# EAGLE design Erica-HAT (EAGLE 6.5.0)
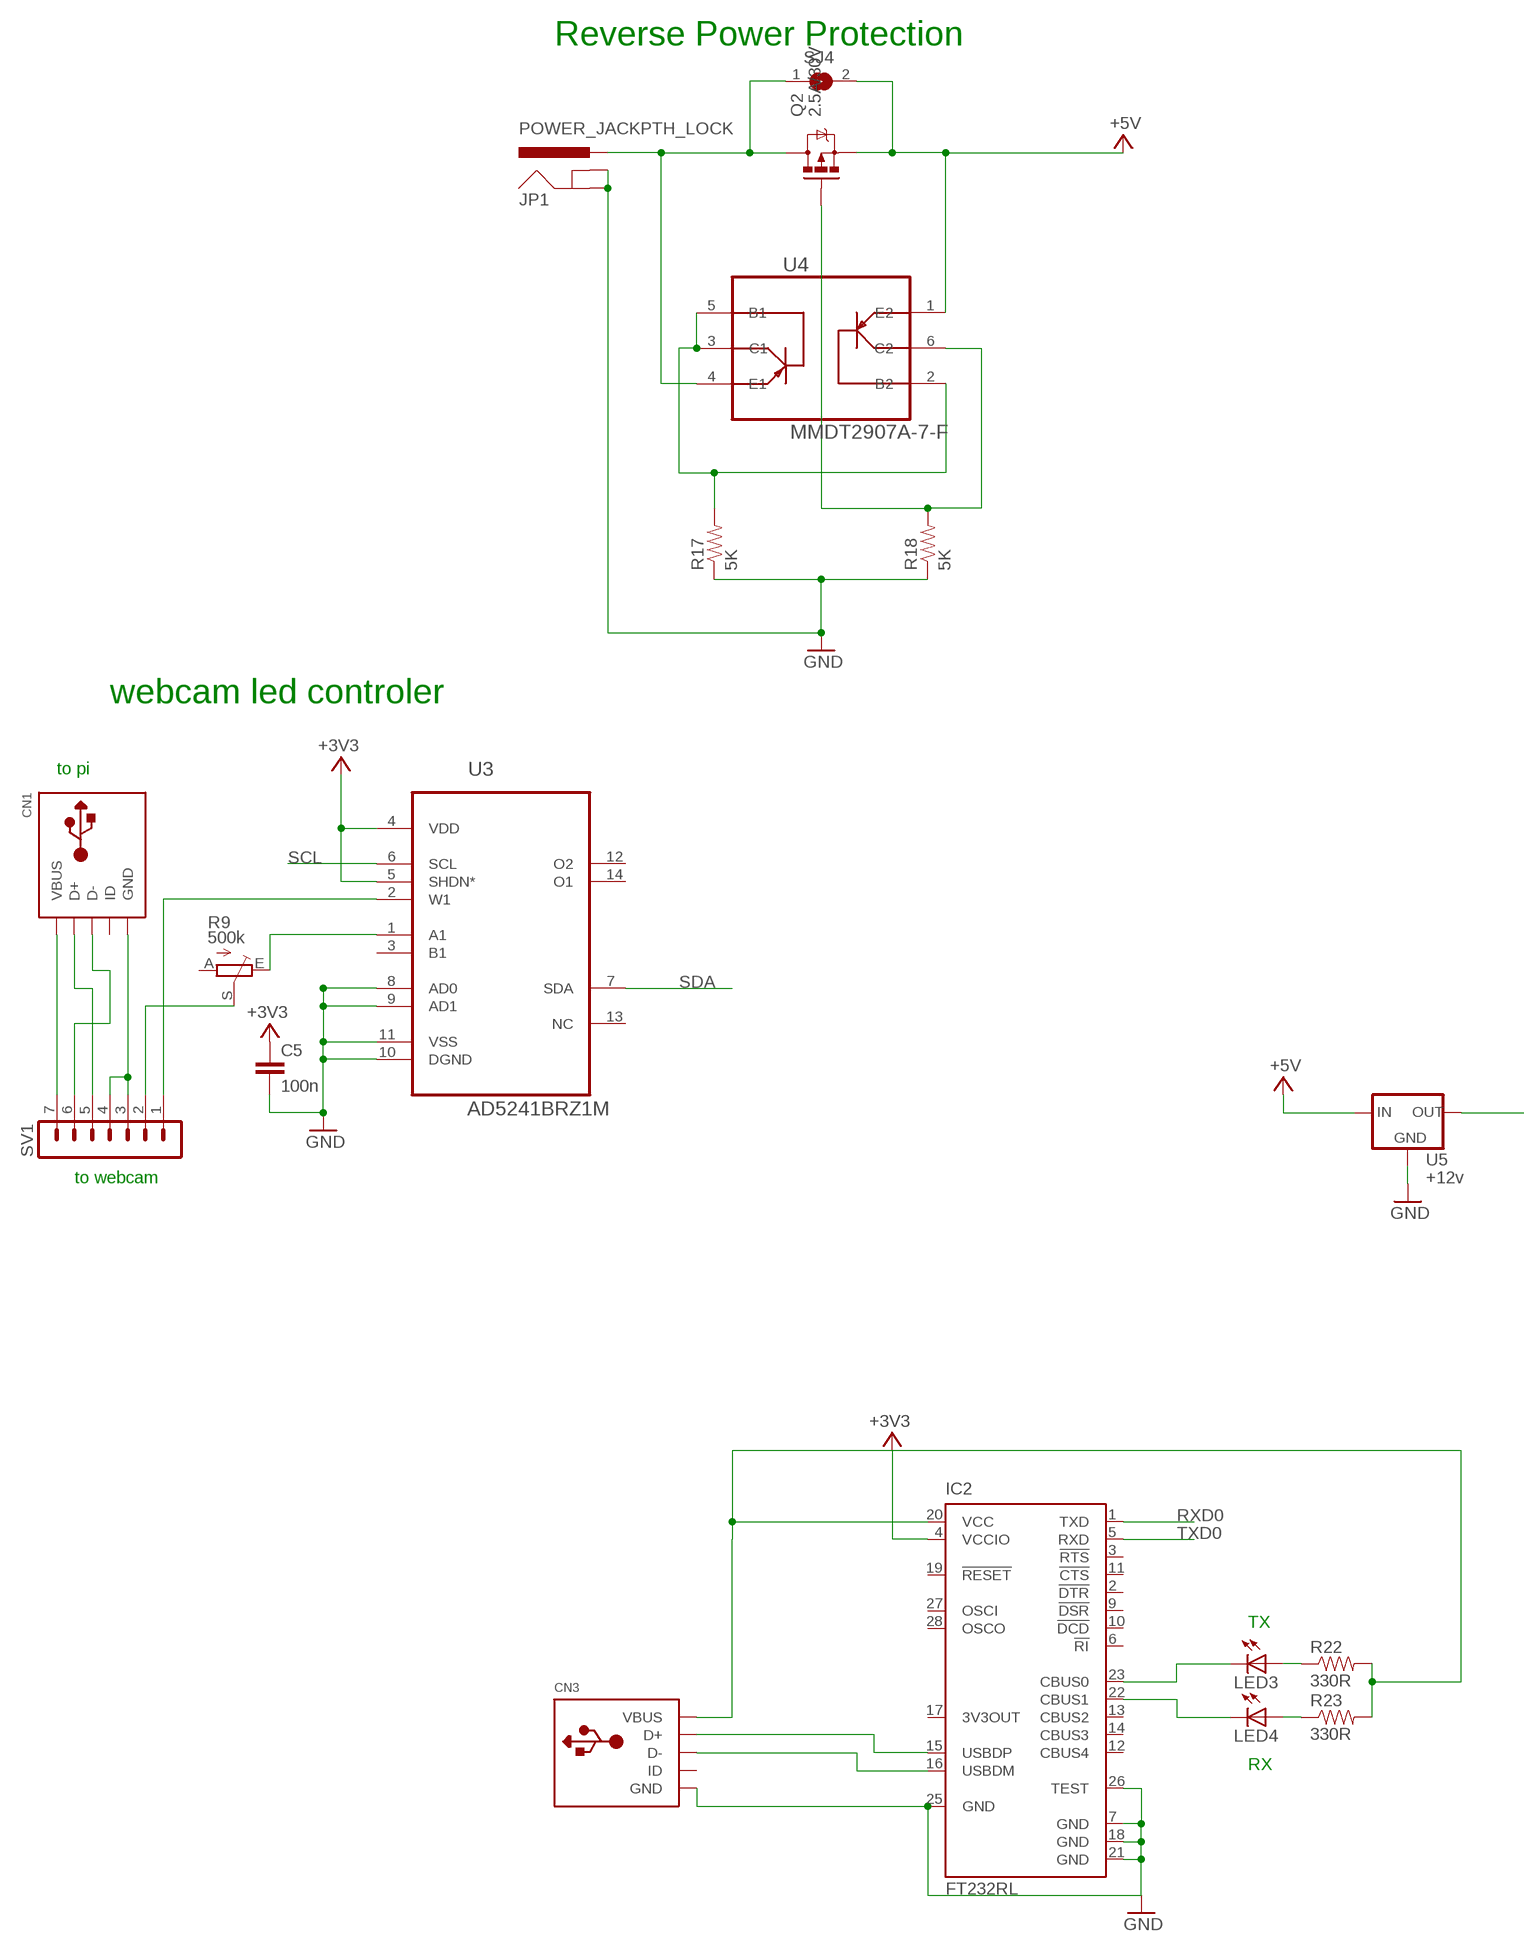
[diagram p0: schematic, sheet 1, part 1 of 2]
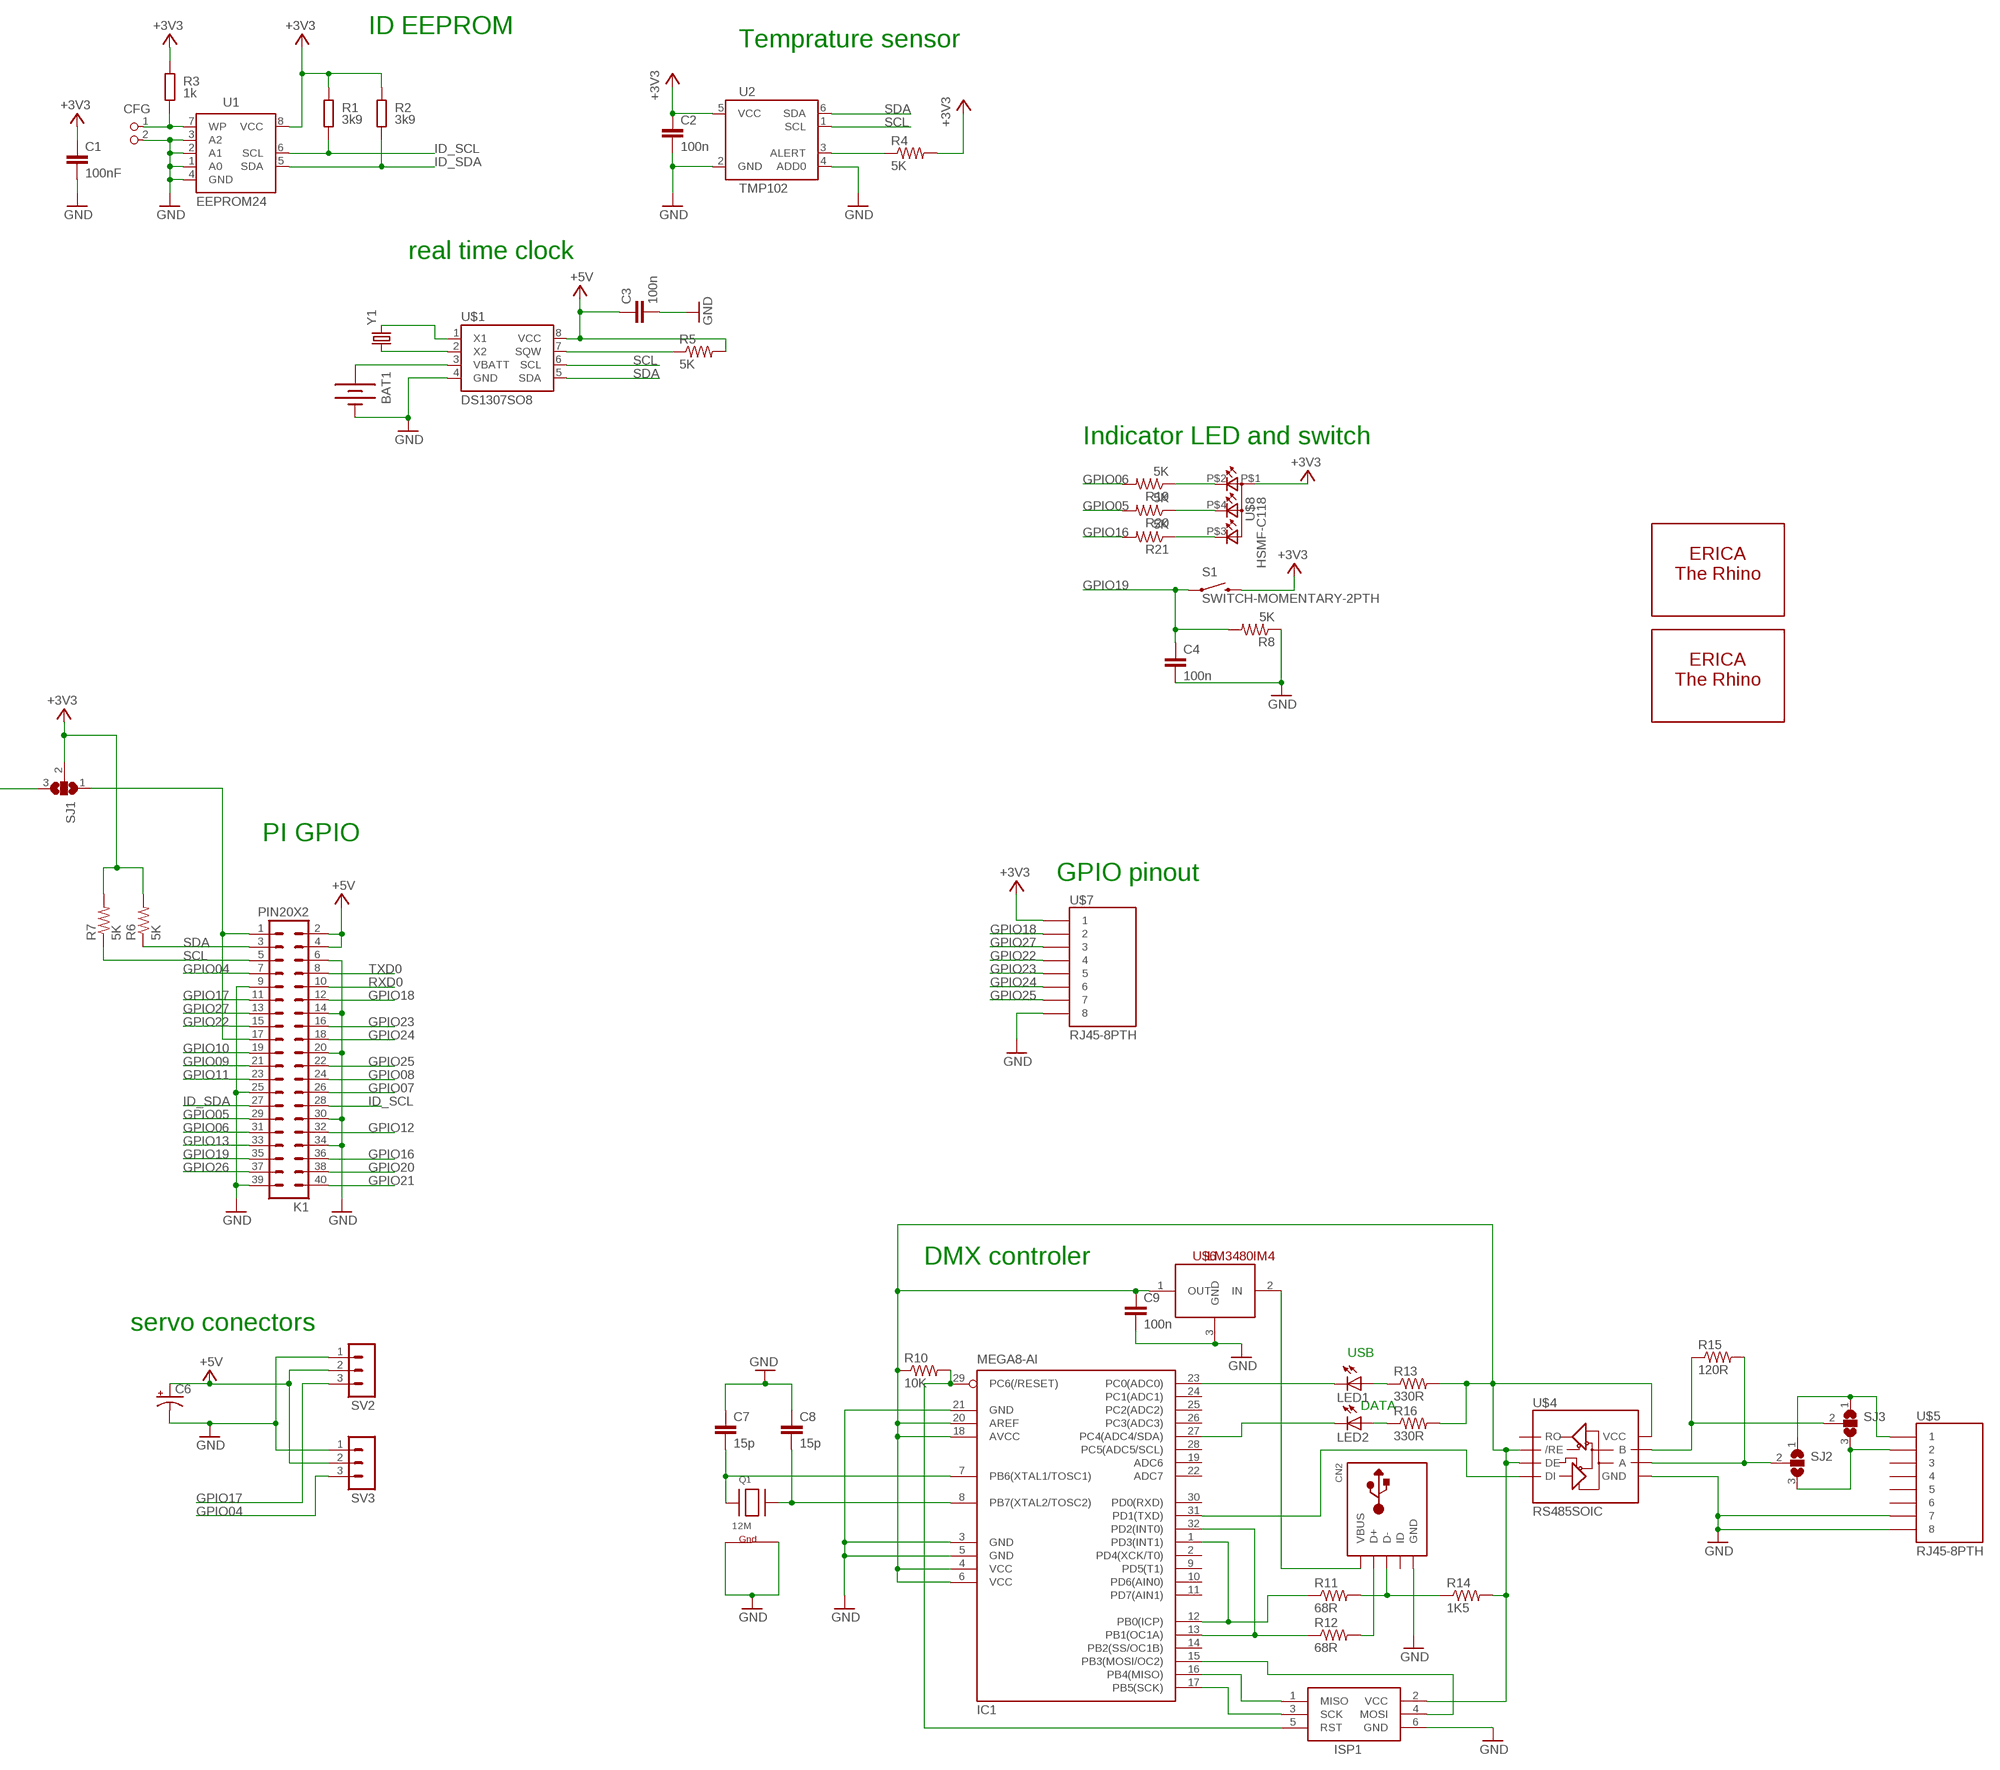
[diagram p1: schematic, sheet 1, part 2 of 2]

## Parts
BAT1  BATTERY12MM  [BATTCON_12MM]
C1  100nF  C-EUC0805K  [C0805K]
C2  100n  CAP0603-CAP  [0603-CAP]
C3  100n  CAP0603-CAP  [0603-CAP]
C4  100n  CAP0603-CAP  [0603-CAP]
C5  100n  CAP0603-CAP  [0603-CAP]
C6  CAP_POLPTH2  [CPOL-RADIAL-10UF-25V]
C7  15p  CAP0603-CAP  [0603-CAP]
C8  15p  CAP0603-CAP  [0603-CAP]
C9  100n  CAP0603-CAP  [0603-CAP]
CFG  PIN2_100  [PIN_W_2]
CN1  USBMINIB  [USB-MINIB]
CN2  USBMINIB  [USB-MINIB]
CN3  USBMINIB  [USB-MINIB]
IC1  MEGA8-AI  [TQFP32-08]
IC2  FT232RL  [SSOP28]
ISP1  AVRISP-6  [AVRISP]
JP1  POWER_JACKPTH_LOCK  [POWER_JACK_PTH_LOCK]
K1  PIN20X2  [PIN_20X2]
LED1  LEDCHIP-LED0603  [CHIP-LED0603]
LED2  LEDCHIP-LED0603  [CHIP-LED0603]
LED3  LEDCHIP-LED0603  [CHIP-LED0603]
LED4  LEDCHIP-LED0603  [CHIP-LED0603]
Q1  12M  XTAL-4-3225  [NX3225]
Q2  2.5A/30V  MOSFET-PCHANNELDMG2307L  [SOT23-3]
R1  3k9  R-EU_M0805  [M0805]
R2  3k9  R-EU_M0805  [M0805]
R3  1k  R-EU_M0805  [M0805]
R4  5K  RESISTOR0603-RES  [0603-RES]
R5  5K  RESISTOR0603-RES  [0603-RES]
R6  5K  RESISTOR0603-RES  [0603-RES]
R7  5K  RESISTOR0603-RES  [0603-RES]
R8  5K  RESISTOR0603-RES  [0603-RES]
R9  500k  TRIM_EU-B25U  [B25U]
R10  10K  RESISTOR0603-RES  [0603-RES]
R11  68R  RESISTOR0603-RES  [0603-RES]
R12  68R  RESISTOR0603-RES  [0603-RES]
R13  330R  RESISTOR0603-RES  [0603-RES]
R14  1K5  RESISTOR0603-RES  [0603-RES]
R15  120R  RESISTOR0603-RES  [0603-RES]
R16  330R  RESISTOR0603-RES  [0603-RES]
R17  5K  RESISTOR0603-RES  [0603-RES]
R18  5K  RESISTOR0603-RES  [0603-RES]
R19  5K  RESISTOR0603-RES  [0603-RES]
R20  5K  RESISTOR0603-RES  [0603-RES]
R21  5K  RESISTOR0603-RES  [0603-RES]
R22  330R  RESISTOR0603-RES  [0603-RES]
R23  330R  RESISTOR0603-RES  [0603-RES]
S1  SWITCH-MOMENTARY-2PTH  [TACTILE-PTH]
SJ1  SJ2W  [SJ_2]
SJ2  SJ2W  [SJ_2]
SJ3  SJ2W  [SJ_2]
SJ4  SJ  [SJ]
SV1  MA07-1  [MA07-1]
SV2  MA03-1  [MA03-1]
SV3  MA03-1  [MA03-1]
U1  EEPROM24  [SOIC8]
U2  TMP102  [SOT563]
U3  AD5241BRZ1M  [SOIC127P600X175-14N]
U4  MMDT2907A-7-F  [SOT65P210X110-6N]
U5  +12v  V_REG_MIC2920  [SOT223]
U$1  DS1307SO8  [SO08]
U$2  ERICALOGO  [ERICA_LOGO]
U$3  ERICASILHOUETTE  [ERICA_SILHOUETTE]
U$4  RS485SOIC  [SO08]
U$5  RJ45-8PTH  [RJ45-8]
U$6  LM3480IM4  [SOT23-3]
U$7  RJ45-8PTH  [RJ45-8]
U$8  HSMF-C118  [HSMF-C118]
Y1  CRYSTAL32-SMD  [CRYSTAL-32KHZ-SMD]

## Nets
+3V3: C1.1 C2.1 C5.1 IC2.4(VCCIO) R1.2 R2.2 R3.2 R4.2 R6.2 R7.2 S1.3 SJ1.2 U1.8(VCC) U2.5(VCC) U3.4(VDD) U3.5(SHDN*) U$7.1 U$8.P$1(A2)
+5V: C3.1 C6.1(+) K1.2 K1.4 Q2.2(S) R5.2 SJ4.2 SV2.2 SV3.2 U4.1(E2) U5.1(IN) U$1.8(VCC)
GND: BAT1.GND(-) C1.2 C2.2 C3.2 C4.2 C5.2 C6.2(-) C7.1 C8.1 C9.2 CFG.2 CN2.GND CN3.GND IC1.3(GND) IC1.5(GND) IC1.21(GND) IC2.7(GND) IC2.18(GND) IC2.21(GND) IC2.25(GND) IC2.26(TEST) ISP1.6(GND) JP1.GND JP1.GNDBREAK K1.6 K1.9 K1.14 K1.20 K1.25 K1.30 K1.34 K1.39 Q1.2(G1) Q1.4(G2) R8.1 R17.1 R18.1 SV2.1 SV3.1 U1.1(A0) U1.2(A1) U1.3(A2) U1.4(GND) U2.2(GND) U2.4(ADD0) U3.8(AD0) U3.9(AD1) U3.10(DGND) U3.11(VSS) U5.2(GND) U$1.4(GND) U$4.5(GND) U$5.7 U$5.8 U$6.3(GND) U$7.8
GPIO04: K1.7 SV3.3
GPIO05: K1.29 R20.2
GPIO06: K1.31 R19.2
GPIO07: K1.26
GPIO08: K1.24
GPIO09: K1.21
GPIO10: K1.19
GPIO11: K1.23
GPIO12: K1.32
GPIO13: K1.33
GPIO16: K1.36 R21.2
GPIO17: K1.11 SV2.3
GPIO18: K1.12 U$7.2
GPIO19: C4.1 K1.35 R8.2 S1.1
GPIO20: K1.38
GPIO21: K1.40
GPIO22: K1.15 U$7.4
GPIO23: K1.16 U$7.5
GPIO24: K1.18 U$7.6
GPIO25: K1.22 U$7.7
GPIO26: K1.37
GPIO27: K1.13 U$7.3
ID_SCL: K1.28 R1.1 U1.6(SCL)
ID_SDA: K1.27 R2.1 U1.5(SDA)
N$1: R4.1 U2.3(ALERT)
N$2: BAT1.PWR@1(+) U$1.3(VBATT)
N$3: CFG.1 R3.1 U1.7(WP)
N$4: R5.1 U$1.7(SQW)
N$5: R9.E U3.1(A1)
N$6: R19.1 U$8.P$2(CRED)
N$7: U$1.1(X1) Y1.X2
N$8: U$1.2(X2) Y1.X1
N$9: R20.1 U$8.P$4(CBLUE)
N$10: R21.1 U$8.P$3(CGREEN)
N$11: SJ1.3 U5.3(OUT)
N$12: SJ2.1 SJ3.1 U$5.1
N$13: CN1.GND SV1.3 SV1.4
N$14: CN1.D+ SV1.5
N$15: CN1.D- SV1.6
N$16: CN1.VBUS SV1.7
N$17: SV1.1 U3.2(W1)
N$18: SJ2.3 SJ3.3 U$5.2
N$19: R9.S SV1.2
N$20: C7.2 IC1.7(PB6(XTAL1/TOSC1)) Q1.1(X1)
N$21: C8.2 IC1.8(PB7(XTAL2/TOSC2)) Q1.3(X2)
N$22: IC1.29(PC6(/RESET)) ISP1.5(RST) R10.2
N$23: IC1.13(PB1(OC1A)) IC1.32(PD2(INT0)) R12.1
N$24: IC1.1(PD3(INT1)) IC1.12(PB0(ICP)) R11.1
N$25: CN2.D- R11.2 R14.1
N$26: CN2.D+ R12.2
N$27: IC1.23(PC0(ADC0)) LED1.C
N$28: LED1.A R13.1
N$29: IC1.31(PD1(TXD)) U$4.4(DI)
N$30: C9.1 IC1.4(VCC) IC1.6(VCC) IC1.18(AVCC) IC1.20(AREF) ISP1.2(VCC) R10.1 R13.2 R14.2 R16.2 U$4.2(/RE) U$4.3(DE) U$4.8(VCC) U$6.1(OUT)
N$31: R15.1 SJ3.2 U$4.7(B)
N$32: R15.2 SJ2.2 U$4.6(A)
N$33: CN2.VBUS U$6.2(IN)
N$34: IC1.16(PB4(MISO)) ISP1.1(MISO)
N$35: IC1.17(PB5(SCK)) ISP1.3(SCK)
N$36: IC1.15(PB3(MOSI/OC2)) ISP1.4(MOSI)
N$37: IC1.27(PC4(ADC4/SDA)) LED2.C
N$38: JP1.PWR Q2.3(D) SJ4.1 U4.4(E1)
N$39: LED2.A R16.1
N$40: R17.2 U4.2(B2) U4.3(C1) U4.5(B1)
N$42: Q2.1(G) R18.2 U4.6(C2)
N$44: LED3.A R22.1
N$45: CN3.D- IC2.16(USBDM)
N$46: K1.1 K1.17 SJ1.1
N$47: CN3.D+ IC2.15(USBDP)
N$48: LED4.A R23.1
N$49: IC2.23(CBUS0) LED3.C
N$50: IC2.22(CBUS1) LED4.C
N$51: CN3.VBUS IC2.20(VCC) R22.2 R23.2
RXD0: IC2.1(TXD) K1.10
SCL: K1.5 R7.1 U2.1(SCL) U3.6(SCL) U$1.6(SCL)
SDA: K1.3 R6.1 U2.6(SDA) U3.7(SDA) U$1.5(SDA)
TXD0: IC2.5(RXD) K1.8
Unconnected: CN1.ID CN2.ID CN3.ID IC1.2(PD4(XCK/T0)) IC1.9(PD5(T1)) IC1.10(PD6(AIN0)) IC1.11(PD7(AIN1)) IC1.14(PB2(SS/OC1B)) IC1.19(ADC6) IC1.22(ADC7) IC1.24(PC1(ADC1)) IC1.25(PC2(ADC2)) IC1.26(PC3(ADC3)) IC1.28(PC5(ADC5/SCL)) IC1.30(PD0(RXD)) IC2.2(!DTR) IC2.3(!RTS) IC2.6(!RI) IC2.9(!DSR) IC2.10(!DCD) IC2.11(!CTS) IC2.12(CBUS4) IC2.13(CBUS2) IC2.14(CBUS3) IC2.17(3V3OUT) IC2.19(!RESET) IC2.27(OSCI) IC2.28(OSCO) R9.A U3.3(B1) U3.12(O2) U3.13(NC) U3.14(O1) U$4.1(RO) U$5.3 U$5.4 U$5.5 U$5.6

## Notes on the sheet
- Reverse Power Protection
- ID EEPROM
- Temprature sensor
- real time clock
- Indicator LED and switch
- webcam led controler
- to pi
- to webcam | PI GPIO
- GPIO pinout
- TX
- DMX controler
- RX
- servo conectors
- USB
- DATA

## Library data of the parts
BAT1 = SparkFun-Electromechanical:BATTERY: Battery Holders Various common sizes : AA, AAA, 18650 (PRT-12895), 20mm coin cell and 12mm coin cell. 20MM_4LEGS, BATT-10373; PROD_ID: BATT-08044
C1 = resistor:C-EU: CAPACITOR, European symbol; DIELECTRIC: X7R
C2-C5 C7-C9 = SparkFun-Passives:CAP: Capacitor Standard 0603 ceramic capacitor, and 0.1" leaded capacitor.
C6 = SparkFun:CAP_POL: Capacitor Polarized These are standard SMD and PTH capacitors. Normally 10uF, 47uF, and 100uF in electrolytic and tantalum varieties. Always verify the external diameter of the through hole cap, it varies with capacity, voltage, and manufacturer. The EIA devices should be standard.
CFG = FLYFISH:PIN2
CN1-CN3 = adafruit:USB: USB Connectors USBMINIB - Surface Mount Female Mini-B USB Connector 4UConnector: 06564 By microbuilder.eu Thru-hole RA Female Mini-B USB Connector 4UConnector: 18732 By ladyada.net
IC1 = atmel:MEGA8: MICROCONTROLLER 8 Kbytes FLASH, 1 kbytes SRAM, 512 bytes EEPROM, USART, 6-channel 10 bit ADC, 2-channel 8 bit ADC Pin compatible with Atmega48, ATMega88, ATMega168 Source: avr.lbr; MPN: ATMEGA8-16AU; OC_FARNELL: 9171371; OC_NEWARK: 73M8863
IC2 = ftdichip:FT232R: Source: http://www.ftdichip.com/Documents/DataSheets/DS_FT232R_v104.pdf; MPN: FT232RL; OC_FARNELL: 1146032; OC_NEWARK: 91K9918
ISP1 = adafruit:AVRISP: AVR ISP HEADER Standard 6 pin header for AVR programming
JP1 = SparkFun-Connectors:POWER_JACK: Power Jack This is the standard 5.5mm barrel jack for power. The PTH is the most common, proven, reliable, footprint. The Slot footprint only works if the mill layer is transmitted to the PCB fab house so be warned. Mating wall wart : TOL-00298 (and others); PROD_ID: CONN-08197; SF_ID: PRT-00119
K1 = FLYFISH:PIN20X2
LED1-LED4 = adafruit:LED: LED OSRAM: - CHIPLED LG R971, LG N971, LY N971, LG Q971, LY Q971, LO R971, LY R971 LH N974, LH R974 LS Q976, LO Q976, LY Q976 LO Q996 - Hyper CHIPLED LW Q18S LB Q993, LB Q99A, LB R99A - SideLED LS A670, LO A670, LY A670, LG A670, LP A670 LB A673, LV A673, LT A673, LW A673 LH A674 LY A675 LS A676, LA A676, LO A676, LY A676, LW A676 LS A679, LY A679, LG A679 - Hyper Micro SIDELED® LS Y876, LA Y876, LO Y876, LY Y876 LT Y87S - SmartLED LW L88C, LW L88S LB L89C, LB L89S, LG L890 LS L89K, LO L89K, LY L89K LS L896, LA L896, LO L896, LY L896 - TOPLED LS T670, LO T670, LY T670, LG T670, LP T670 LSG T670, LSP T670, LSY T670, LOP T670, LYG T670 LG T671, LOG T671, LSG T671 LB T673, LV T673, LT T673, LW T673 LH T674 LS T676, LA T676, LO T676, LY T676, LB T676, LH T676, LSB T676, LW T676 LB T67C, LV T67C, LT T67C, LS T67K, LO T67K, LY T67K, LW E67C LS E67B, LA E67B, LO E67B, LY E67B, LB E67C, LV E67C, LT E67C LW T67C LS T679, LY T679, LG T679 LS T770, LO T770, LY T770, LG T770, LP T770 LB T773, LV T773, LT T773, LW T773 LH T774 LS E675, LA E675, LY E675, LS T675 LS T776, LA T776, LO T776, LY T776, LB T776 LHGB T686 LT T68C, LB T68C - Hyper Mini TOPLED® LB M676 - Mini TOPLED Santana® LG M470 LS M47K, LO M47K, LY M47K Source: http://www.osram.convergy.de/
Q1 = adafruit:XTAL-4: Classic 4-pin 3.2 x 2.5mm crystal
Q2 = SparkFun-DiscreteSemi:MOSFET-PCHANNEL: Generic PMOSFET IRLML2244 - TRANS-11153 (SOT-23 -20V -4.3A) (1.Gate 2.Source 3.Drain) FQP27P06 - COM-10349 <http://www.sparkfun.com/products/10349> (TO-220 -60V -27A) (1.Gate 2.Source 3.Drain); PROD_ID: TRANS-11308
R1-R3 = resistor:R-EU_: RESISTOR, European symbol; TOLERANCE: 5%
R4-R8 R10-R23 = SparkFun-Passives:RESISTOR: Resistor Basic schematic elements and footprints for 0603, 1206, and PTH resistors.
R9 = pot:TRIM_EU-: POTENTIOMETER
S1 = SparkFun-Electromechanical:SWITCH-MOMENTARY-2: Various NO switches- pushbuttons, reed, etc
SJ1-SJ3 = jumper:SJ2W: SMD solder JUMPER
SJ4 = jumper:SJ: SMD solder JUMPER
SV1 = con-lstb:MA07-1: PIN HEADER; OC_FARNELL: unknown; OC_NEWARK: unknown
SV2 SV3 = con-lstb:MA03-1: PIN HEADER; OC_FARNELL: unknown; OC_NEWARK: unknown
U1 = FLYFISH:EEPROM24
U2 = SparkFun-Sensors:TMP102: I2C degC temp sensor; PROD_ID: IC-09303
U3 = onecall:AD5241BRZ1M: I2C Compatible Digital Potentiometer; MPN: AD5241BRZ1M; OC_FARNELL: 9425896; OC_NEWARK: 31M4023; PACKAGE: 14-Lead SOIC_N; SUPPLIER: Analog Devices
U4 = onecall:MMDT2907A-7-F: DUAL PNP SMALL SIGNAL SURFACE MOUNT TRANSISTOR; MPN: MMDT2907A-7-F; OC_FARNELL: 1773590; OC_NEWARK: 51R6827; PACKAGE: SOT-363-6; SUPPLIER: Diodes Inc
U5 = SparkFun-PowerIC:V_REG_MIC2920: MIC2920A (http://www.micrel.com/_PDF/mic2920.pdf) - 400mA output LDO Regulator
U$1 = SparkFun-FreqCtrl:DS1307: I2C real-time clock with battery backup.
U$2 U$3 = silkscreen_ERICA:ERICA: ERICA The Rhino silkscreen artwork
U$4 = SparkFun-DigitalIC:RS485: RS485 transceiver
U$5 U$7 = SparkFun:RJ45-8: RJ45 Jack Simple RJ45, 8-pin connection - connector for common Cat5, Cat5e, and Cat6 Ethernet cables. Footprint not yet proven in production. Connector sku is PRT-00643; Breakout PCB sku is BOB-00716.
U$6 = SparkFun-PowerIC:LM3480IM4: Small package linear regulator
U$8 = farnell-parts:HSMF-C118
Y1 = SparkFun-FreqCtrl:CRYSTAL: Various standard crystals. Proven footprints.; PROD_ID: XTAL-07894

## Board
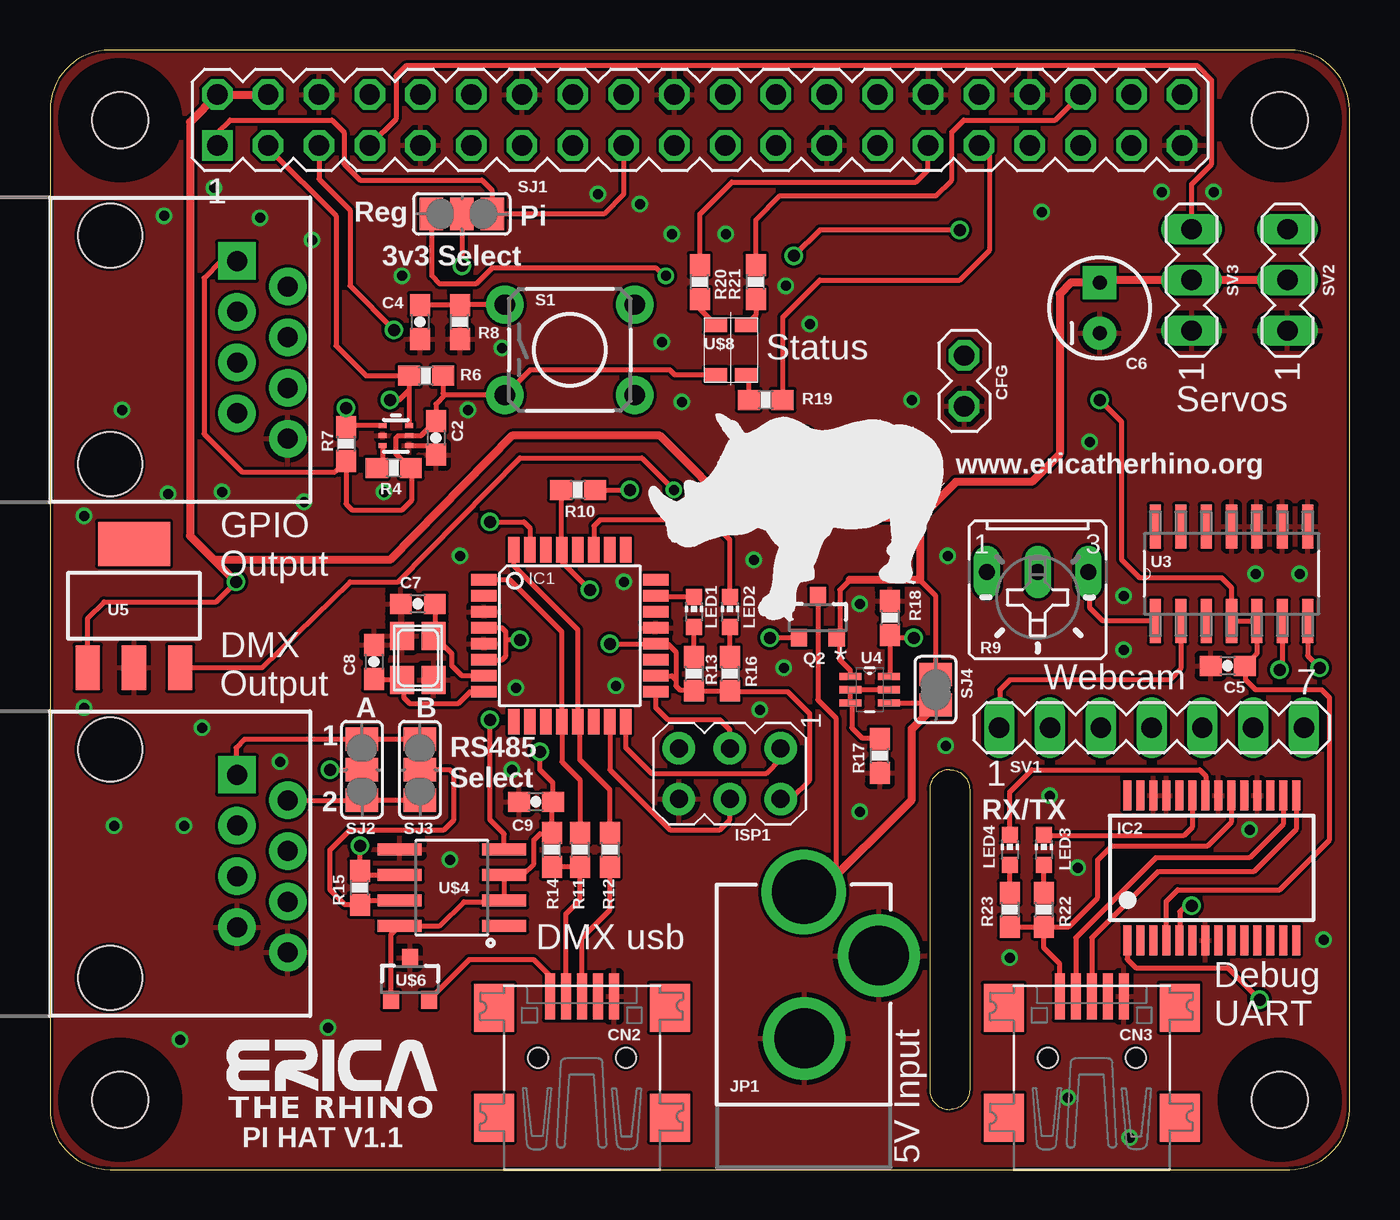
[diagram p2: board, top side]
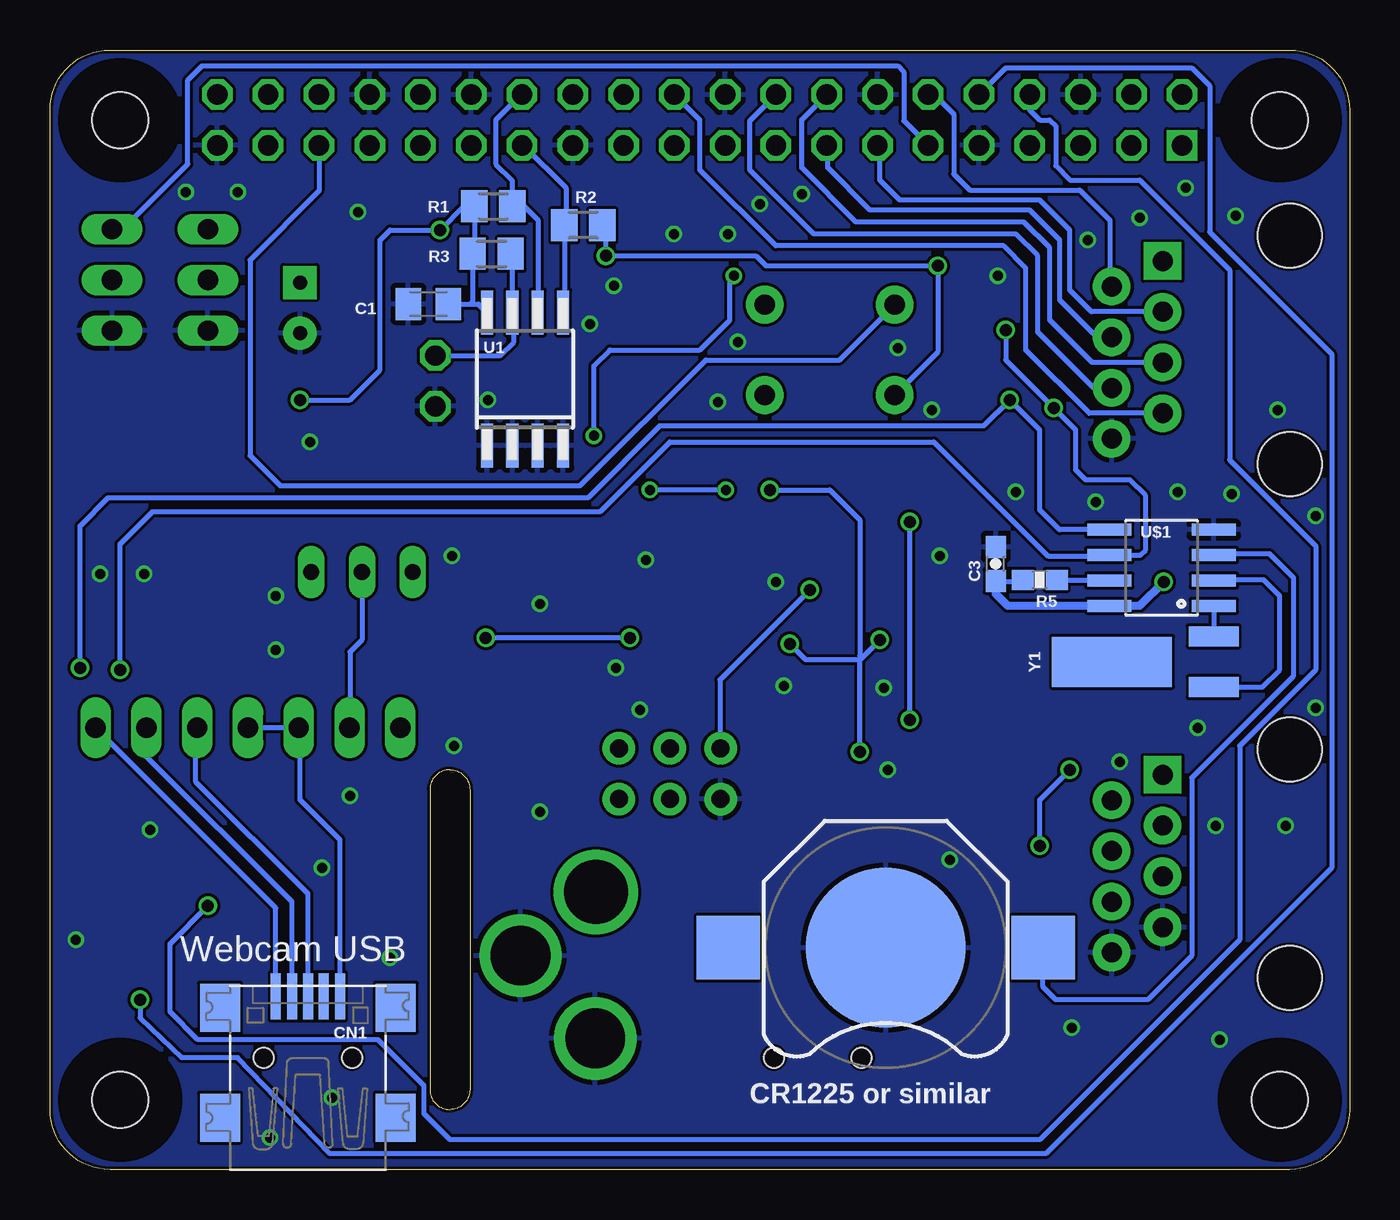
[diagram p3: board, bottom side, seen from below]

Size 65 x 56 mm. Coordinates in mm from the lower left corner, seen from the top.
Outline: 0,3 arc90 3,0 62,0 arc90 65,3 65,53 arc90 62,56 3,56 arc90 0,53 0,3
Outline: 44,19 44,4 arc90 45,3 arc90 46,4 46,19 arc90 45,20 arc90 44,19
Copper layers (1*16): Top 0.035mm / dielectric 1.5mm / Bottom 0.035mm
Design rules "hackvana": minimum track width 6mil, minimum drill 0.3mm, track to track 6mil, track to pad 6mil, pad to pad 6mil, via to via 6mil, smd to smd 0mil, copper to edge 6mil, drill to drill 6mil, minimum pad ring 10mil, minimum via ring 6mil, stop-mask expansion 2mil, vias tented up to drill 100mil, thermal gap 10mil
Holes 2.8 mm at 3.5,3.5 3.5,52.5 61.5,52.5 61.5,3.5
tRestrict: area 1.9,51 to 5,54; area 60,51 to 63,54; area 60,1.9 to 63,5; area 1.9,1.9 to 5,5
bRestrict: area 1.9,1.9 to 5,5; area 1.9,51 to 5,54; area 60,1.9 to 63,5; area 60,51 to 63,54
Milling: 6 lines

### Footprints (pad centres in the part's own frame; a part is rotated, then mirrored left to right if it is on the bottom)
BATTCON_12MM = smd 8 x 8: GND 0,0 | smd 3.175 x 3.175: PWR@1 -7.874,0; PWR@2 7.874,0
C0805K = smd 1.3 x 1.6: 1 -1,0; 2 1,0
0603-CAP = smd 1.1 x 1: 1 -0.85,0; 2 0.85,0
CPOL-RADIAL-10UF-25V = drill 0.7 pad 1.651 square: 1 1.27,0 | drill 0.7 pad 1.651: 2 -1.27,0
PIN_W_2 = drill 1.016 octagon: 1 0,0; 2 0,-2.54
USB-MINIB = smd 0.5 x 2.308: D+ 0,4.064; D- -0.8,4.064; GND 1.6,4.064; ID 0.8,4.064; VBUS -1.6,4.064 | smd 2 x 2.4: GND1 -4.4,-2; GND2 -4.4,3.5; GND3 4.4,3.5; GND4 4.4,-2 | hole 1: -2.2,1; 2.2,1
TQFP32-08 = smd 1.27 x 0.559: 1 -4.293,2.8; 2 -4.293,2; 3 -4.293,1.2; 4 -4.293,0.4; 5 -4.293,-0.4; 6 -4.293,-1.2; 7 -4.293,-2; 8 -4.293,-2.8; 17 4.293,-2.8; 18 4.293,-2; 19 4.293,-1.2; 20 4.293,-0.4; 21 4.293,0.4; 22 4.293,1.2; 23 4.293,2; 24 4.293,2.8 | smd 0.559 x 1.27: 9 -2.8,-4.293; 10 -2,-4.293; 11 -1.2,-4.293; 12 -0.4,-4.293; 13 0.4,-4.293; 14 1.2,-4.293; 15 2,-4.293; 16 2.8,-4.293; 25 2.8,4.293; 26 2,4.293; 27 1.2,4.293; 28 0.4,4.293; 29 -0.4,4.293; 30 -1.2,4.293; 31 -2,4.293; 32 -2.8,4.293
SSOP28 = smd 0.4 x 1.5: 1 -4.225,-3.625; 2 -3.575,-3.625; 3 -2.925,-3.625; 4 -2.275,-3.625; 5 -1.625,-3.625; 6 -0.975,-3.625; 7 -0.325,-3.625; 8 0.325,-3.625; 9 0.975,-3.625; 10 1.625,-3.625; 11 2.275,-3.625; 12 2.925,-3.625; 13 3.575,-3.625; 14 4.225,-3.625; 15 4.225,3.625; 16 3.575,3.625; 17 2.925,3.625; 18 2.275,3.625; 19 1.625,3.625; 20 0.975,3.625; 21 0.325,3.625; 22 -0.325,3.625; 23 -0.975,3.625; 24 -1.625,3.625; 25 -2.275,3.625; 26 -2.925,3.625; 27 -3.575,3.625; 28 -4.225,3.625
AVRISP = drill 0.9 pad 1.626: 1 -1.27,2.54; 2 1.27,2.54; 3 -1.27,0; 4 1.27,0; 5 -1.27,-2.54; 6 1.27,-2.54
POWER_JACK_PTH_LOCK = drill 2.997 pad 4.115: GND 0.025,6.557; GNDBREAK 3.762,10.7 | drill 3.2 pad 4.115: PWR 0,13.878
PIN_20X2 = drill 1.016 square: 1 -24.13,-1.27 | drill 1.016 octagon: 2 -24.13,1.27; 3 -21.59,-1.27; 4 -21.59,1.27; 5 -19.05,-1.27; 6 -19.05,1.27; 7 -16.51,-1.27; 8 -16.51,1.27; 9 -13.97,-1.27; 10 -13.97,1.27; 11 -11.43,-1.27; 12 -11.43,1.27; 13 -8.89,-1.27; 14 -8.89,1.27; 15 -6.35,-1.27; 16 -6.35,1.27; 17 -3.81,-1.27; 18 -3.81,1.27; 19 -1.27,-1.27; 20 -1.27,1.27; 21 1.27,-1.27; 22 1.27,1.27; 23 3.81,-1.27; 24 3.81,1.27; 25 6.35,-1.27; 26 6.35,1.27; 27 8.89,-1.27; 28 8.89,1.27; 29 11.43,-1.27; 30 11.43,1.27; 31 13.97,-1.27; 32 13.97,1.27; 33 16.51,-1.27; 34 16.51,1.27; 35 19.05,-1.27; 36 19.05,1.27; 37 21.59,-1.27; 38 21.59,1.27; 39 24.13,-1.27; 40 24.13,1.27
CHIP-LED0603 = smd 0.8 x 0.8: A 0,-0.75; C 0,0.75
NX3225 = smd 1.4 x 1.2: 1 -1.1,0.8; 2 1.1,0.8; 3 1.1,-0.8; 4 -1.1,-0.8
SOT23-3 = smd 0.8 x 0.9: 1 -0.95,-1; 2 0.95,-1; 3 0,1.1
M0805 = smd 1.3 x 1.6: 1 -0.95,0; 2 0.95,0
0603-RES = smd 1.1 x 1: 1 -0.85,0; 2 0.85,0
B25U = drill 0.813 long: A 2.54,-0.889; E -2.54,-0.889; S 0,-0.889
TACTILE-PTH = drill 1.016 pad 1.88: 1 -3.251,2.261; 2 3.251,2.261; 3 -3.251,-2.261; 4 3.251,-2.261
SJ_2 = smd 1.168 x 1.6: 1 -1.524,0; 2 0,0; 3 1.524,0
SJ = smd 1.168 x 1.6: 1 -0.762,0; 2 0.762,0
MA07-1 = drill 1.016 long: 1 -7.62,0; 2 -5.08,0; 3 -2.54,0; 4 0,0; 5 2.54,0; 6 5.08,0; 7 7.62,0
MA03-1 = drill 1.016 long: 1 -2.54,0; 2 0,0; 3 2.54,0
SOIC8 = smd 0.6 x 2.2: 1 -1.905,-3.33; 2 -0.635,-3.33; 3 0.635,-3.33; 4 1.905,-3.33; 5 1.905,3.33; 6 0.635,3.33; 7 -0.635,3.33; 8 -1.905,3.33
SOT563 = smd 0.25 x 0.4: 1 -0.5,-0.66; 2 0,-0.66; 3 0.5,-0.66; 4 0.5,0.66; 5 0,0.66; 6 -0.5,0.67
SOIC127P600X175-14N = smd 2.184 x 0.559: 1 -2.362,3.81; 2 -2.362,2.54; 3 -2.362,1.27; 4 -2.362,0; 5 -2.362,-1.27; 6 -2.362,-2.54; 7 -2.362,-3.81; 8 2.362,-3.81; 9 2.362,-2.54; 10 2.362,-1.27; 11 2.362,0; 12 2.362,1.27; 13 2.362,2.54; 14 2.362,3.81
SOT65P210X110-6N = smd 1.118 x 0.356: 1 -0.965,0.66; 2 -0.965,0; 3 -0.965,-0.66; 4 0.965,-0.66; 5 0.965,0; 6 0.965,0.66
SOT223 = smd 1.219 x 2.235: 1 -2.311,-3.099; 2 0,-3.099; 3 2.311,-3.099 | smd 3.6 x 2.2: 4 0,3.099
SO08 = smd 0.61 x 2.21: 1 -1.905,-2.616; 2 -0.635,-2.616; 3 0.635,-2.616; 4 1.905,-2.616; 5 1.905,2.616; 6 0.635,2.616; 7 -0.635,2.616; 8 -1.905,2.616
RJ45-8 = drill 1 pad 1.88 square: 1 -4.445,6.35 | drill 1 pad 1.88: 2 -3.175,8.89; 3 -1.905,6.35; 4 -0.635,8.89; 5 0.635,6.35; 6 1.905,8.89; 7 3.175,6.35; 8 4.445,8.89 | hole 3.2: -5.715,0; 5.715,0
HSMF-C118 = smd 1.1 x 0.7: P$1 0.6,0.35; P$2 2.1,0.35; P$3 2.1,2.85; P$4 0.6,2.85
CRYSTAL-32KHZ-SMD = smd 2.5 x 6: SHEILD 0,5.08 | smd 1 x 2.5: X1 -1.27,0; X2 1.27,0

### Placement (x,y rotation side)
BAT1  23.2,11.1 180 bottom
C1  46.08,43.3 180 bottom
C2  19.3,36.6 270 top
C3  17.7,30.3 90 bottom
C4  18.5,42.4 270 top
C5  58.9,25.2 180 top
C6  52.5,43.1 90 top
C7  18.4,28.3 0 top
C8  16.2,25.4 270 top
C9  24.3,18.4 180 top
CFG  45.73,40.72 0 top
CN1  52.1,4.6 0 bottom
CN2  26.6,4.6 0 top
CN3  52.1,4.6 0 top
IC1  26,26.7 0 top
IC2  58.1,15.1 0 top
ISP1  34,19.8 270 top
JP1  37.7,0 0 top
K1  32.5,52.5 0 top
LED1  32.2,27.9 0 top
LED2  34,27.9 0 top
LED3  49.7,16 0 top
LED4  48,16 0 top
Q1  18.4,25.6 270 top
Q2  38.4,27.6 0 top
R1  42.83,48.18 180 bottom
R2  38.33,47.24 0 bottom
R3  42.91,45.8 180 bottom
R4  17.2,35.1 0 top
R5  15.5,29.5 180 bottom
R6  18.8,39.7 0 top
R7  14.8,36.3 270 top
R8  20.5,42.4 90 top
R9  49.4,29 180 top
R10  26.4,34 180 top
R11  26.5,16 270 top
R12  28,16 270 top
R13  32.2,24.8 270 top
R14  25.1,16 90 top
R15  15.5,14.1 90 top
R16  34,24.8 270 top
R17  41.5,20.7 90 top
R18  42,27.6 270 top
R19  35.8,38.5 0 top
R20  32.5,44.4 90 top
R21  35.3,44.4 90 top
R22  49.7,13 270 top
R23  48,13 270 top
S1  26,41 0 top
SJ1  20.6,47.8 180 top
SJ2  15.6,20 270 top
SJ3  18.5,20 270 top
SJ4  44.3,24 90 top
SV1  55.1,22.1 0 top
SV2  61.9,44.5 90 top
SV3  57.1,44.5 90 top
U1  41.24,39.53 0 bottom
U2  17.3,36.7 270 top
U3  59.1,29.8 90 top
U4  41,24 0 top
U5  4.2,28.2 0 top
U$1  9.4,30.1 90 bottom
U$2  8.1,2.2 0 top
U$3  29.5,27.3 0 top
U$4  20.1,14.1 90 top
U$5  3,15.3 270 top
U$6  18,9.5 0 top
U$7  3,41 270 top
U$8  32.7,39.4 0 top
Y1  6.8,25.4 90 bottom

### Tracks (layer width: path | path; a pad name or v marks a point on that pad's centre or on a via)
+3V3  (via drill 0.6)
  Top 0.254: 19.74,38.74 S1.3 24.01,40 31,40 31.25,39.75 U$8.P$1 | 19.74,38.74 19.3,38.3 C2.1 18.55,36.7 U2.5 17.4,36.7 17.3,36.6 17.3,35.8 18,35.1 R4.2 18.1,35.05 18.1,33.5 17.6,33 15.1,33 14.8,33.3 R7.2 14.25,34.9 9.6,34.9 7.7,36.8 7.7,44.6 8.54,45.45 U$7.1 | R6.2 19.65,38.83 19.74,38.74 | v45.5,47 38.5,47 v37.2,45.7 | SJ1.2 v20.6,45.2 | v52.5,38.5 53.6,37.4 53.6,30.5 54.5,29.6 58.6,29.6 59.1,29.1 U3.4 U3.5 60.37,25.82 C5.1 59.8,25.15 59.8,24.5 60.3,24 63.6,24 64,23.6 64,16.5 61.5,14 56.4,14 55.83,13.43 IC2.4
  Bottom 0.254: C1.1 44,43.3 | 44,43.3 43.58,43.3 U1.8 | 44,43.3 43.85,43.44 R3.2 43.77,45.88 R1.2 44.32,48.18 v45.5,47 48,47 48.5,46.5 48.5,40 50,38.5 v52.5,38.5 | R2.2 37.2,47.06 v37.2,45.7 29.7,45.7 29.2,45.2 v20.6,45.2 20.6,40.89 S1.3
+5V  (via drill 0.6)
  Top 0.254: SJ4.2 44.3,28.7 43.5,29.5 | 40,29.5 39.5,29 39.5,26.75 Q2.2 39.5,26.45 39.5,25.5 40.03,24.96 U4.1 | U5.1 1.89,27.59 2.7,28.4 8.3,28.4 v9.3,29.4
  Top 0.406: SV2.2 SV3.2 52.63,44.5 C6.1 51.07,44.37 50.5,43.8 50.5,35.8 49.1,34.4 45.3,34.4 43.5,32.6 | 40,29.5 43.5,29.5 43.5,32.6 | 8.2,30.5 7,31.7 7,52.4 K1.2 K1.4 | 8.2,30.5 v9.3,29.4 | 43.5,32.6 34.6,32.6 30.5,36.7 23.1,36.7 17,30.5 8.2,30.5
  Bottom 0.254: R5.2 16.35,29.45 16.4,29.4 17.65,29.4 C3.1
  Bottom 0.406: v9.3,29.4 10.51,28.2 U$1.8 17.09,28.2 17.7,28.8 C3.1
GND  (via drill 0.5)
  Top 0.254: U2.4 18.85,36.2 C2.2
  other vias: 51.4,15.1 40.5,17.9 40.5,28.3 43.1,38.5 20,15.5 23.1,20 35.5,23 17.6,44.7 31.6,38.4 30.6,41.4 6.5,6.5 36.7,25.1 20.9,38 50.9,3.6 3.2,17.2 3.6,38 1.7,32.7 1.7,23.1 8.2,49.1 5.7,47.7 10.5,47.6 5.9,33.8 58.2,48.9 55.6,48.9 49.6,47.9 31.1,46.8 29.5,48.3 27.4,48.8 13.1,46.5 36.8,44.2 38,42.3 22.6,41.1 23.3,24.1 28.3,24.2 28.7,29.4 13.9,7.1 60,17 63.7,11.5 53.7,26 44.8,21.2 50,18.7 48,10.6 54,1.6 60.3,29.8 62.5,29.8 33.8,46.8 20.5,30.7 7.6,22.1 8.6,33.9 6.7,17.2 35.2,30.5 44.9,30.7 52,36.4 12.7,33.4 16.7,33.9 11.5,20.4 53.7,28.7
  pour Bottom: 0,3 arc90 3,0 62,0 arc90 65,3 65,53 arc90 62,56 3,56 arc90 0,53
  pour Top: 0,3 arc90 3,0 62,0 arc90 65,3 65,53 arc90 62,56 3,56 arc90 0,53
GPIO04
  Top 0.254: SV3.3 57.1,49.3 58.1,50.3 58.1,54.5 57.4,55.2 17.8,55.2 17.3,54.7 17.3,52.54 K1.7
GPIO05
  Top 0.254: R20.2 32.5,47.8 34.1,49.4 43.3,49.4 43.9,50 43.9,51.2 K1.29
GPIO06
  Top 0.254: R19.2 36.65,42.65 38.5,44.5 45.5,44.5 47,46 47,50.7 K1.31
GPIO16
  Top 0.254: R21.2 35.3,47.5 36.5,48.7 44.3,48.7 45.1,49.5 45.1,51.9 45.7,52.5 50.28,52.5 K1.36
GPIO17
  Bottom 0.254: SV2.3 61.36,47.04 58.1,50.3 58.1,54.5 57.4,55.2 22.6,55.2 22.3,54.9 22.3,52.46 K1.11
GPIO18
  Bottom 0.254: K1.12 20.77,53.77 19.8,52.8 19.8,49.8 19,49 13.5,49 12,47.5 12,44.28 U$7.2
GPIO19
  Top 0.254: S1.1 20.51,43.26 R8.2 C4.1
  Bottom 0.254: K1.35 51.55,48.95 55,45.5 55,35.7 53.5,34.2 38.5,34.2 32.2,40.5 25.51,40.5 S1.1
GPIO22
  Bottom 0.254: U$7.4 12.63,41.63 14.5,43.5 14.5,46.5 16,48 24,48 26.1,50.1 26.1,51.18 K1.15
GPIO23
  Bottom 0.254: U$7.5 12.87,40.37 15,42.5 15,46.1 16.3,47.4 24.7,47.4 27.4,50.1 27.4,52.52 K1.16
GPIO24
  Bottom 0.254: U$7.6 12.79,39.09 15.6,41.9 15.6,45.7 16.7,46.8 26.8,46.8 30,50 30,52.46 K1.18
GPIO25
  Bottom 0.254: U$7.7 13.03,37.83 16.2,41 16.2,45.1 17.3,46.2 28.7,46.2 32.5,50 32.5,52.5 K1.22
GPIO27
  Bottom 0.254: U$7.3 12.9,42.91 14,44 14,47 15.5,48.5 22.5,48.5 23.5,49.5 23.5,51.12 K1.13
ID_SCL
  Bottom 0.254: K1.28 41.43,53.77 42.7,52.5 42.7,50.3 41.9,49.5 41.9,48.2 R1.1 41.28,48.18 40.6,47.5 U1.6
ID_SDA
  Bottom 0.254: K1.27 41.33,51.23 39.2,49.1 39.2,47.31 R2.1 39.27,42.92 U1.5
N$1
  Top 0.254: U2.3 16.64,35.39 R4.1
N$2
  Bottom 0.254: U$1.3 6.72,30.8 4,30.8 2.8,29.6 2.8,24.7 7.9,19.6 7.9,10.7 10.1,8.5 14.7,8.5 15.33,9.13 BAT1.PWR@1
N$3
  Bottom 0.254: R3.1 41.88,45.72 U1.7 41.8,42.79 41.8,41.4 42.48,40.72 CFG.1
N$4
  Bottom 0.254: U$1.7 14.62,29.46 R5.1
N$5
  Top 0.254: U3.1 52.66,27.44 52,28.1 52,29.83 R9.E
N$6
  Top 0.254: R19.1 34.95,39.6 U$8.P$2
N$7
  Bottom 0.254: U$1.1 6.78,26.69 Y1.X2
N$8
  Bottom 0.254: Y1.X1 4.37,24.13 3.5,25 3.5,28.7 4.3,29.5 6.75,29.5 U$1.2
N$9
  Top 0.254: R20.1 32.5,43.05 U$8.P$4
N$10
  Top 0.254: R21.1 35.3,42.75 U$8.P$3
N$11  (via drill 0.5)
  Top 0.254: 19.08,46.18 SJ1.3 19.1,47.78 19.1,44.7 19.5,44.3 21.3,44.3 22.1,45.1 30.3,45.1 30.7,44.7 v30.8,44.7 | U5.3 10.6,25.1 15,29.4 17.4,29.4 23.5,35.6 29.6,35.6 v31.2,34 | v35,34 35.1,34 v37.8,36.7
  Bottom 0.254: v31.2,34 v35,34 | v37.8,36.7 37.8,40.2 37,41 32.5,41 31,42.5 31,44.5 v30.8,44.7
N$12
  Top 0.254: SJ3.1 SJ2.1 9.72,21.52 9.3,21.1 9.3,19.8 U$5.1
N$13
  Bottom 0.254: CN1.GND 50.5,16.5 52.5,18.5 52.5,22.04 SV1.3 SV1.4
N$14
  Bottom 0.254: CN1.D+ 52.1,13.8 57.7,19.4 57.7,22.04 SV1.5
N$15
  Bottom 0.254: CN1.D- 52.9,13.4 60.2,20.7 60.2,22.08 SV1.6
N$16
  Bottom 0.254: CN1.VBUS 53.7,13.08 SV1.7
N$17
  Top 0.254: U3.2 56.56,25.06 56,24.5 48,24.5 47.5,24 47.5,22.12 SV1.1
N$18
  Top 0.254: U$5.2 SJ2.3 SJ3.3
N$19
  Bottom 0.254: R9.S 49.4,26.5 50,25.9 50,22.12 SV1.2
N$20
  Top 0.254: C7.2 19.25,26.75 Q1.1 20.1,25.8 20.1,25.2 20.6,24.7 IC1.7
N$21
  Top 0.254: IC1.8 21,23.9 20.4,23.3 18,23.3 17.7,23.6 17.7,24.4 Q1.3 16.25,24.5 C8.2
N$22  (via drill 0.6)
  Top 0.254: R10.2 25.55,31.04 IC1.29 25.6,30.4 v27,29
  Bottom 0.254: v27,29 31.5,24.5 31.5,21.11 ISP1.5
N$23
  Top 0.254: R12.1 28,19 26.5,20.5 26.5,22.31 IC1.13 26.4,27 23.2,30.2 IC1.32
N$24
  Top 0.254: R11.1 26.5,19.5 25.6,20.4 IC1.12 25.6,26.9 23,29.5 IC1.1
N$25
  Top 0.254: CN2.D- 25.8,12.8 26.5,13.5 R11.2 R14.1
N$26
  Top 0.254: CN2.D+ 26.6,11.6 28,13 R12.2
N$27
  Top 0.254: LED1.C 30.34,28.65 IC1.23
N$28
  Top 0.254: R13.1 LED1.A
N$29  (via drill 0.6)
  Top 0.254: U$4.4 22.72,16.78 22,17.5 v22,22.5 | v22,32.4 23.7,32.4 24,32.1 IC1.31
  Bottom 0.254: v22,22.5 v22,32.4
N$30  (via drill 0.6)
  Top 0.254: IC1.6 22.6,25.5 22.8,25.7 22.8,26.5 | 22.8,26.5 22.8,26.9 22.6,27.1 IC1.4 | U$6.1 17.05,11.76 U$4.8 19.5,12.2 20.7,13.4 22.65,13.4 U$4.2 U$4.3 23.64,14.73 24.2,15.3 24.2,16.5 24.5,16.8 25.05,16.8 R14.2 25.1,18.35 C9.1 25.15,19.35 24.5,20 v24.5,20.9 | IC1.18 31.1,24.7 31.3,24.5 | 31.3,24.5 31.3,24.2 31.5,24 32.15,24 R13.2 R16.2 33.55,23.9 36.9,23.9 38,22.8 38,19.5 37.03,18.53 ISP1.2 | 31.3,24.5 31.3,25.9 30.9,26.3 IC1.20 v28,26.3 | v23.5,26.5 22.8,26.5 | R10.1 v29,34
  Bottom 0.254: v24.5,20.9 24.5,25.5 | 24.5,25.5 24.4,25.6 | 24.4,25.6 v23.5,26.5 | 24.5,25.5 27.2,25.5 v28,26.3 | v29,34 26,34 24.5,32.5 24.5,25.7 24.4,25.6
N$31
  Top 0.254: U$4.7 15.71,13.46 R15.1 14.75,13.25 14,14 14,16 15,17 19.7,17 20.2,17.5 20.2,19.8 20,20 SJ3.2
N$32  (via drill 0.6)
  Top 0.254: U$4.6 15.71,14.73 R15.2 v15.5,16.2 | v14,20 SJ2.2
  Bottom 0.254: v15.5,16.2 15.5,18.5 v14,20
N$33
  Top 0.254: CN2.VBUS 25,9.7 24.2,10.5 20.95,10.5 U$6.2
N$34
  Top 0.254: ISP1.1 36.54,20.54 35.8,19.8 30.1,19.8 28.8,21.1 IC1.16
N$35
  Top 0.254: ISP1.3 34,22 33.5,22.5 30.9,22.5 30.3,23.1 IC1.17
N$36
  Top 0.254: IC1.15 28,20 31,17 33.5,17 34,17.5 ISP1.4
N$37
  Top 0.254: LED2.C 34,31.5 33,32.5 27.5,32.5 27.2,32.2 IC1.27
N$38
  Top 0.254: U4.4 44.2,23.34 SJ4.1 | Q2.3 38.4,23.5 39.3,22.6 39.3,14.98 38.2,13.88
  Top 0.406: JP1.PWR 38.2,13.88 38.48,13.88 43.1,18.5 43.1,22.04 SJ4.1
N$39
  Top 0.254: R16.1 LED2.A
N$40
  Top 0.254: U4.5 U4.2 U4.3 40.1,23.27 40.1,22.1 40.6,21.6 41.45,21.6 R17.2
N$42  (via drill 0.6)
  Top 0.254: U4.6 42,24.7 R18.2 42.15,26.6 v43.2,26.6 | Q2.1 v36,26.6
  Bottom 0.254: v36,26.6 v43.2,26.6
N$44
  Top 0.254: R22.1 LED3.A
N$45
  Top 0.254: IC2.16 61.67,17.27 60,15.6 55.3,15.6 51.3,11.6 CN3.D-
N$46
  Top 0.254: K1.17 28.69,48.79 27.7,47.8 SJ1.1 22.1,47.82 22.1,49 21.6,49.5 15.5,49.5 14.7,50.3 14.7,51.9 14.1,52.5 9,52.5 8.37,51.87 K1.1
N$47
  Top 0.254: IC2.15 62.33,17.02 60.2,14.9 55.4,14.9 52.1,11.6 CN3.D+
N$48
  Top 0.254: R23.1 LED4.A
N$49
  Top 0.254: IC2.23 57.12,17.12 56.7,16.7 49.75,16.7 LED3.C
N$50
  Top 0.254: LED4.C 48,18.9 49.1,20 57.5,20 57.8,19.7 57.8,18.75 IC2.22
N$51
  Top 0.254: R23.2 R22.2 | CN3.VBUS 50.5,10.3 49.7,11.1 R22.2 | R22.2 50.95,12.15 52.4,13.6 52.4,15.5 53.1,16.2 57.9,16.2 59.1,17.4 59.1,18.7 IC2.20
RXD0  (via drill 0.6)
  Top 0.254: IC2.1 53.88,10.53 54.3,10.1 58.9,10.1 v60.5,8.5
  Bottom 0.254: v60.5,8.5 60.5,7.6 58.4,5.6 55.6,5.6 51,0.8 15.2,0.8 0.9,15.1 0.9,40.8 7,46.9 7,54.2 7.9,55.1 17.2,55.1 K1.10
SCL  (via drill 0.6)
  Top 0.254: K1.5 13.45,49.55 15,48 15,44.2 v17.2,42 | 15,37.35 R7.1 | v14.8,38.1 R7.1 | U2.1 14.85,37.2 R7.1 | U3.6 61.64,25.14 v61.5,25
  Bottom 0.254: v17.2,42 17.2,40.5 v14.8,38.1 13.7,37 13.7,35 13.2,34.5 11,34.5 10.2,33.7 10.2,31 10.46,30.73 U$1.6 12.05,30.7 15.1,30.7 20.8,36.4 34,36.4 37.5,32.9 59.9,32.9 61.5,31.3 v61.5,25
SDA  (via drill 0.6)
  Top 0.254: K1.3 10.91,51.09 14.3,47.7 14.3,41.2 15.8,39.7 R6.1 17.95,39 | 17.95,39 17.95,37.22 U2.6 | v17,38.5 17.45,38.5 17.95,39 | U3.7 62.91,25.69 v63.5,25.1
  Bottom 0.254: U$1.5 14.51,32.01 15.5,33 15.5,37 v17,38.5 18.3,37.2 34.5,37.2 38.1,33.6 62.1,33.6 63.5,32.2 v63.5,25.1
TXD0  (via drill 0.6)
  Top 0.254: v57.1,13.2 56.8,13.2 56.5,12.9 56.5,11.5 IC2.5
  Bottom 0.254: K1.8 15.99,52.99 15.5,52.5 15,52.5 14.7,52.2 14.7,50.2 14,49.5 10.5,49.5 6,45 6,35.5 1.7,31.2 1.7,25 5.5,21.2 5.5,11.5 15.5,1.5 45,1.5 46.3,2.8 46.3,4.2 48.6,6.5 57.6,6.5 59,7.9 59,11.3 v57.1,13.2

### Text on the board
tPlace: Reg | Pi | 3v3 Select | Status | Servos | GPIO / Output | DMX / Output | Webcam | RS485 / Select | RX/TX | DMX usb | Debug / UART | 5V Input
bPlace: Webcam USB | CR1225 or similar
tNames: www.ericatherhino.org | A | B | 1 | 2 | PI HAT V1.1